# Altium project STM32_Esqumaticos.PrjPCB
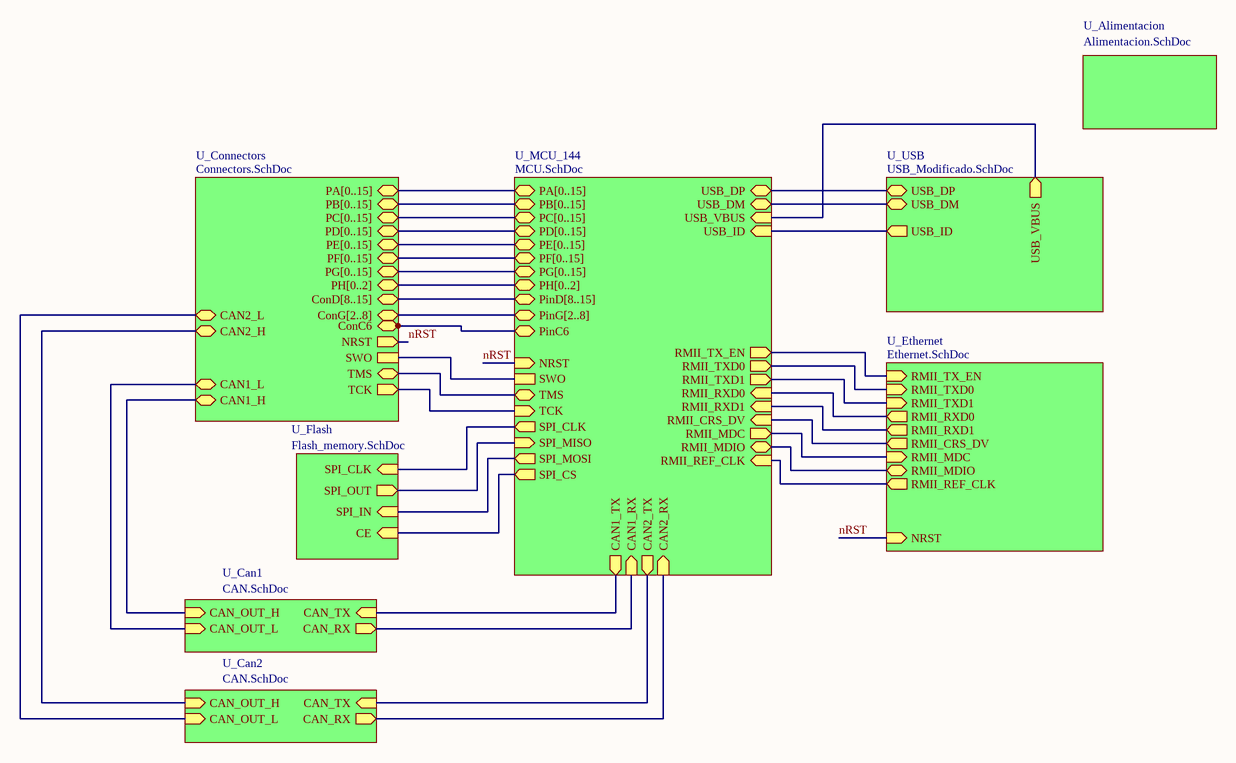
[diagram p0: STM32_TOP.SchDoc]
9 sheets, 175 parts. Net scope: hierarchical (ports join the sheet entries above them; power ports are global).
Board files: MB1137.PcbDoc, STM32_PCB.PcbDoc
Sheets:
  STM32_TOP.SchDoc
    U_MCU_144 = MCU.SchDoc
    U_Ethernet = Ethernet.SchDoc
    U_Connectors = Connectors.SchDoc
      U_ADC1 = ADC.SchDoc
      U_ADC2 = ADC.SchDoc
    U_USB = USB_Modificado.SchDoc
    U_Flash = Flash_memory.SchDoc
    U_Alimentacion = Alimentacion.SchDoc
    U_Can1 = CAN.SchDoc
    U_Can2 = CAN.SchDoc

## Sheet STM32_TOP.SchDoc
size A4

### Sub-sheets
U_Alimentacion = Alimentacion.SchDoc: no entries
U_Can1 = CAN.SchDoc: CAN_OUT_H (in), CAN_OUT_L (in), CAN_RX (out), CAN_TX (in)
U_Can2 = CAN.SchDoc: CAN_OUT_H (in), CAN_OUT_L (in), CAN_RX (out), CAN_TX (in)
U_Connectors = Connectors.SchDoc: PA[0..15] (bidir), PB[0..15] (bidir), PC[0..15] (bidir), PD[0..15] (bidir), PE[0..15] (bidir), PF[0..15] (bidir), PG[0..15] (bidir), PH[0..2] (bidir), CAN2_H (bidir), CAN2_L (bidir), CAN1_H (bidir), CAN1_L (bidir), ConD[8..15] (bidir), ConG[2..8] (bidir), TCK (out), TMS (bidir), SWO, NRST (out), ConC6 (bidir)
U_Ethernet = Ethernet.SchDoc: RMII_TXD0 (in), RMII_TX_EN (in), RMII_RXD0 (out), RMII_REF_CLK (out), RMII_CRS_DV (out), RMII_MDC (in), RMII_MDIO (bidir), NRST (in), RMII_TXD1 (in), RMII_RXD1 (out)
U_Flash = Flash_memory.SchDoc: SPI_CLK (in), SPI_OUT (out), SPI_IN (in), CE (in)
U_MCU_144 = MCU.SchDoc: PA[0..15] (bidir), PB[0..15] (bidir), PC[0..15] (bidir), PD[0..15] (bidir), PE[0..15] (bidir), PF[0..15] (bidir), PG[0..15] (bidir), PH[0..2] (bidir), USB_DM (bidir), USB_DP (bidir), USB_ID (in), USB_VBUS (in), RMII_TXD0 (out), RMII_TX_EN (out), RMII_RXD0 (in), RMII_REF_CLK (in), RMII_CRS_DV (in), RMII_MDC (out), RMII_MDIO (bidir), RMII_TXD1 (out), RMII_RXD1 (in), SPI_MISO (in), SPI_MOSI (out), SPI_CS (out), SPI_CLK (out), CAN1_TX (out), CAN1_RX (in), CAN2_TX (out), CAN2_RX (in), PinD[8..15] (bidir), PinG[2..8] (bidir), TCK (in), TMS (bidir), SWO, NRST (in), PinC6 (bidir)
U_USB = USB_Modificado.SchDoc: USB_DM (bidir), USB_DP (bidir), USB_ID (out), USB_VBUS (out)

### Nets
USB_PWR: sheet U_MCU_144/USB_VBUS, sheet U_USB/USB_VBUS
CAN_N: sheet U_Connectors/CAN2_L, sheet U_Can2/CAN_OUT_L
CAN_N: sheet U_Connectors/CAN1_L, sheet U_Can1/CAN_OUT_L  [a separate net that carries the same name]
CAN_P: sheet U_Connectors/CAN2_H, sheet U_Can2/CAN_OUT_H
CAN_P: sheet U_Connectors/CAN1_H, sheet U_Can1/CAN_OUT_H  [a separate net that carries the same name]
CE: sheet U_MCU_144/SPI_CS, sheet U_Flash/CE
ConC6: sheet U_MCU_144/PinC6, sheet U_Connectors/ConC6
DATA_N: sheet U_MCU_144/USB_DM, sheet U_USB/USB_DM
DATA_P: sheet U_MCU_144/USB_DP, sheet U_USB/USB_DP
nRST: sheet U_MCU_144/NRST, sheet U_Ethernet/NRST, sheet U_Connectors/NRST
PA1: sheet U_MCU_144/RMII_REF_CLK, sheet U_Ethernet/RMII_REF_CLK
PA2: sheet U_MCU_144/RMII_MDIO, sheet U_Ethernet/RMII_MDIO
PA7: sheet U_MCU_144/RMII_CRS_DV, sheet U_Ethernet/RMII_CRS_DV
PA10: sheet U_MCU_144/USB_ID, sheet U_USB/USB_ID
PA13: sheet U_MCU_144/TMS, sheet U_Connectors/TMS
PA14: sheet U_MCU_144/TCK, sheet U_Connectors/TCK
PB3: sheet U_MCU_144/SWO, sheet U_Connectors/SWO
PB5: sheet U_MCU_144/CAN2_RX, sheet U_Can2/CAN_RX
PB6: sheet U_MCU_144/CAN2_TX, sheet U_Can2/CAN_TX
PB13: sheet U_MCU_144/RMII_TXD1, sheet U_Ethernet/RMII_TXD1
PB14: sheet U_MCU_144/SPI_MISO, sheet U_Flash/SPI_OUT
PC1: sheet U_MCU_144/RMII_MDC, sheet U_Ethernet/RMII_MDC
PC4: sheet U_MCU_144/RMII_RXD0, sheet U_Ethernet/RMII_RXD0
PC5: sheet U_MCU_144/RMII_RXD1, sheet U_Ethernet/RMII_RXD1
PD0: sheet U_MCU_144/CAN1_RX, sheet U_Can1/CAN_RX
PD1: sheet U_MCU_144/CAN1_TX, sheet U_Can1/CAN_TX
PG11: sheet U_MCU_144/RMII_TX_EN, sheet U_Ethernet/RMII_TX_EN
PG13: sheet U_MCU_144/RMII_TXD0, sheet U_Ethernet/RMII_TXD0
SPI_CLK: sheet U_MCU_144/SPI_CLK, sheet U_Flash/SPI_CLK
SPI_IN: sheet U_MCU_144/SPI_MOSI, sheet U_Flash/SPI_IN

### Buses and harness runs
bus sheet U_Connectors/ConD[8..15] = sheet U_MCU_144/PinD[8..15]
bus sheet U_Connectors/ConG[2..8] = sheet U_MCU_144/PinG[2..8]
bus sheet U_Connectors/PA[0..15] = sheet U_MCU_144/PA[0..15]
bus sheet U_Connectors/PB[0..15] = sheet U_MCU_144/PB[0..15]
bus sheet U_Connectors/PC[0..15] = sheet U_MCU_144/PC[0..15]
bus sheet U_Connectors/PD[0..15] = sheet U_MCU_144/PD[0..15]
bus sheet U_Connectors/PE[0..15] = sheet U_MCU_144/PE[0..15]
bus sheet U_Connectors/PF[0..15] = sheet U_MCU_144/PF[0..15]
bus sheet U_Connectors/PG[0..15] = sheet U_MCU_144/PG[0..15]
bus sheet U_Connectors/PH[0..2] = sheet U_MCU_144/PH[0..2]

## Sheet MCU.SchDoc: MCU
size A3; DocumentNumber: MB1137; Revision: B-01; SheetNumber: 2; SheetTotal: 6; Project: NUCLEO-XXXXZX
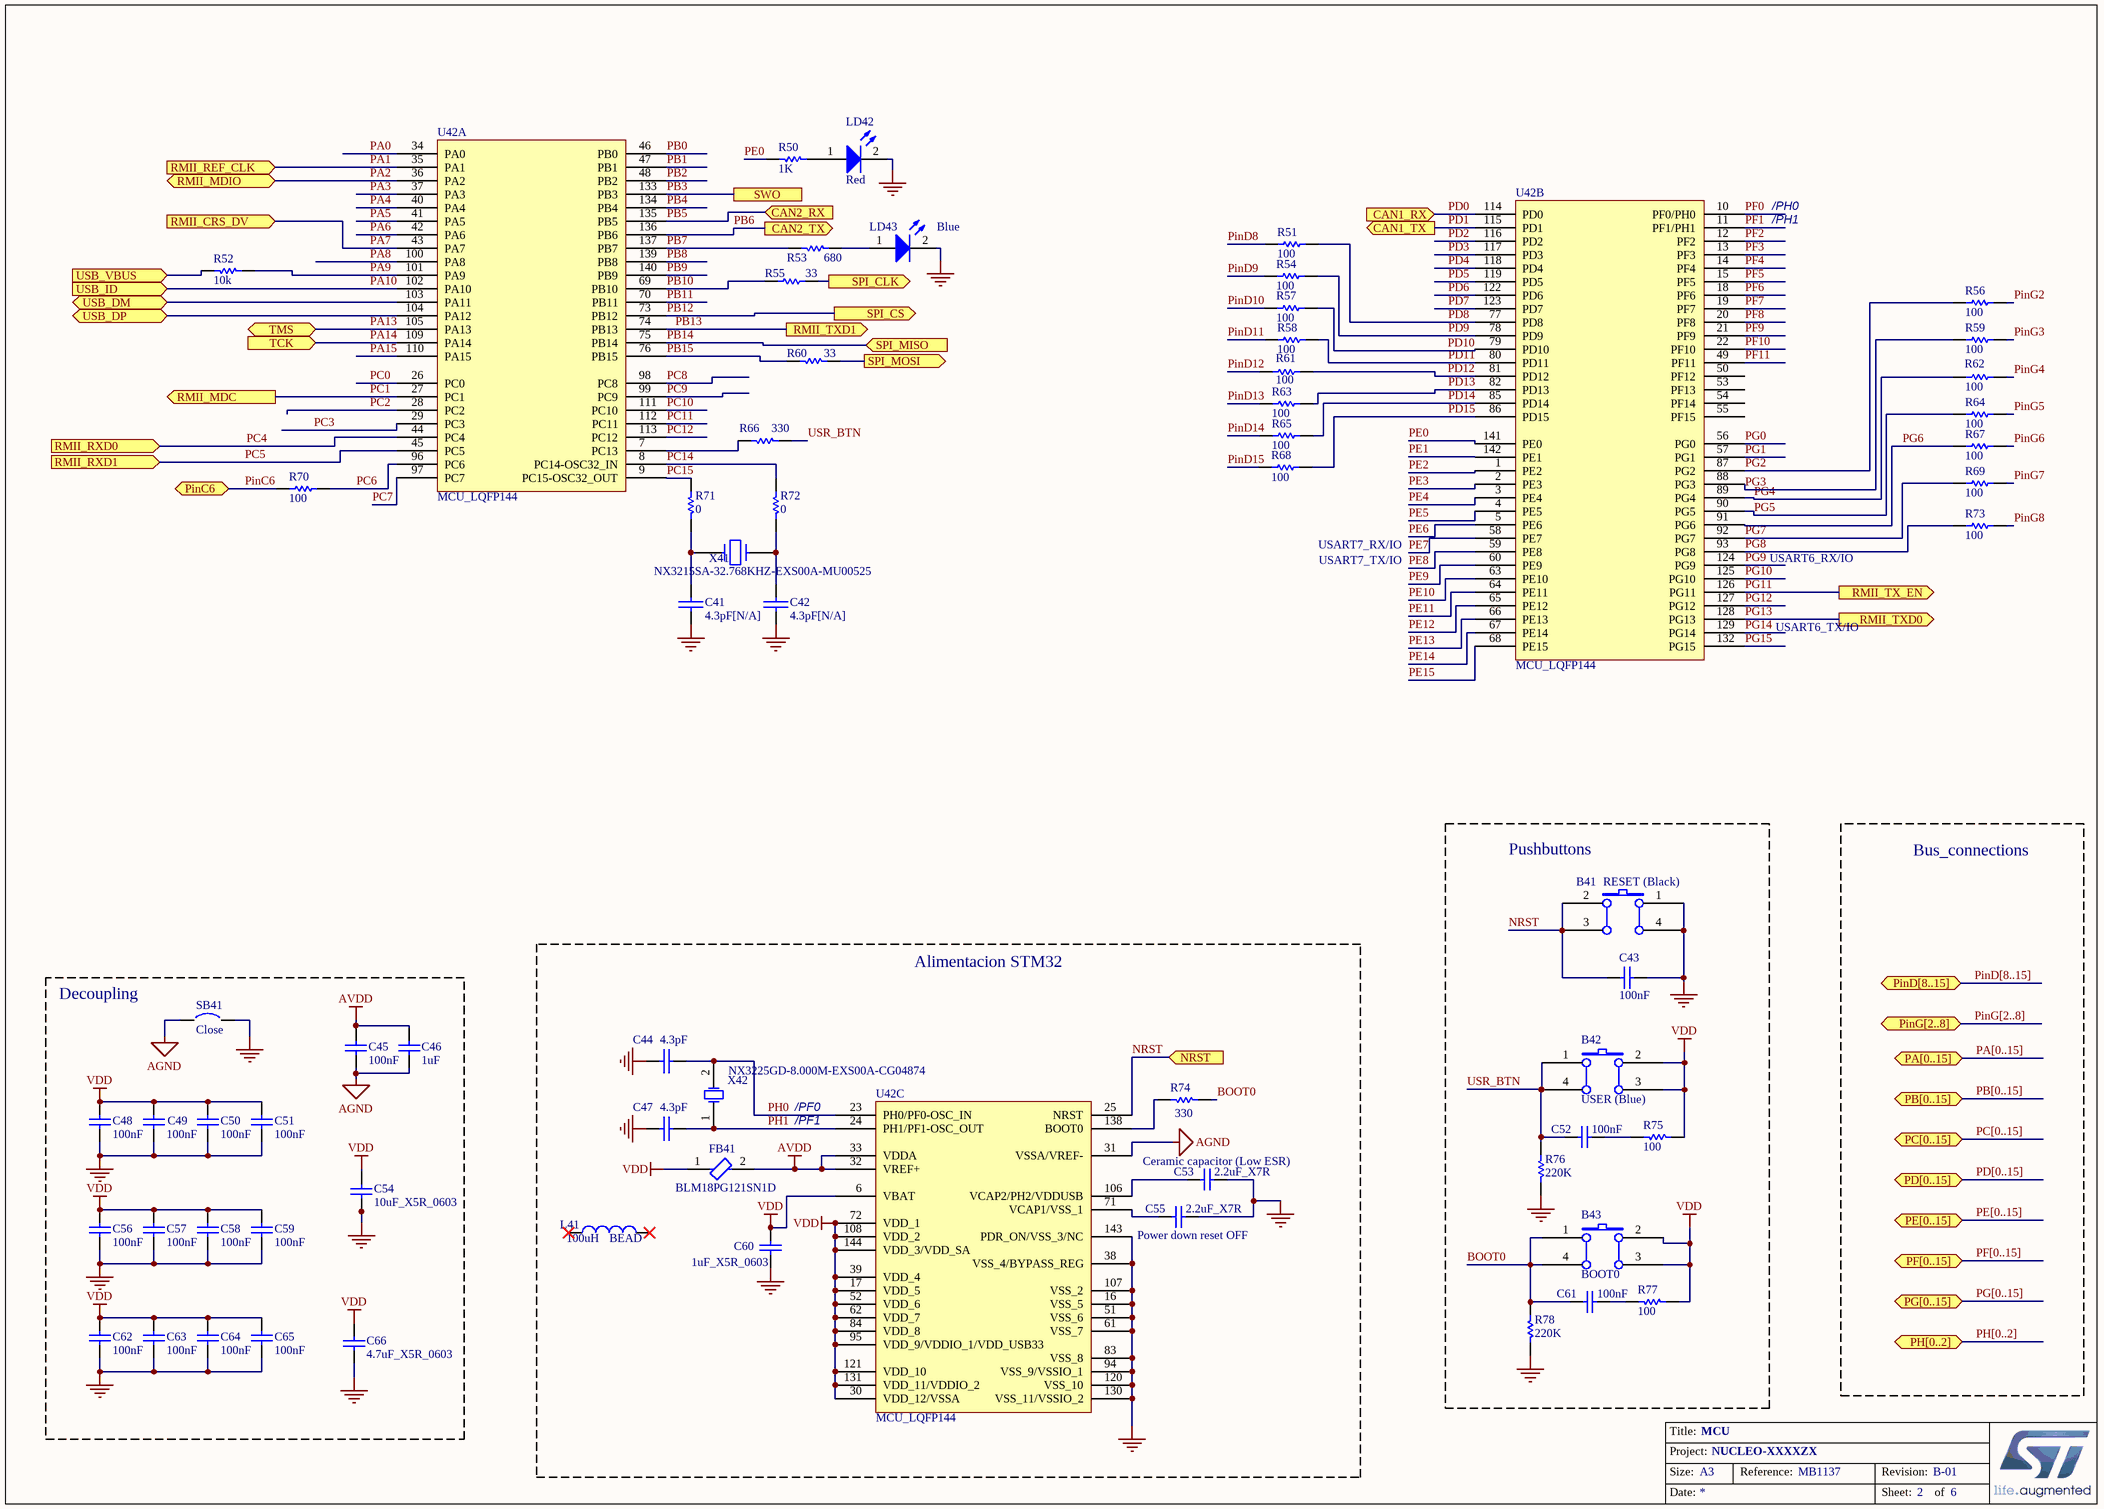
[diagram p1: MCU.SchDoc]

### Parts
B41  RESET (Black)  [PB-6X6mm-Black]
B42  USER (Blue)  [PB-6X6mm-Blue]
B43  BOOT0  [PB-6X6mm-Blue]
C41  4.3pF[N/A]  [0603C]
C42  4.3pF[N/A]  [0603C]
C43  100nF  [0603C]
C44  4.3pF  [0603C]
C45  100nF  [0603C]
C46  1uF  [0603C]
C47  4.3pF  [0603C]
C48  100nF  [0603C]
C49  100nF  [0603C]
C50  100nF  [0603C]
C51  100nF  [0603C]
C52  100nF  [0603C]
C53  2.2uF_X7R  [TAN-A]
C54  10uF_X5R_0603  [0603C]
C55  2.2uF_X7R  [TAN-A]
C56  100nF  [0603C]
C57  100nF  [0603C]
C58  100nF  [0603C]
C59  100nF  [0603C]
C60  1uF_X5R_0603  [0603C]
C61  100nF  [0603C]
C62  100nF  [0603C]
C63  100nF  [0603C]
C64  100nF  [0603C]
C65  100nF  [0603C]
C66  4.7uF_X5R_0603  [0603C]
FB41  BLM18PG121SN1D  [FP-BLM18-0_15-t0_8-IPC_A]
L41  BEAD  value 100uH  (graphical)
LD42  Red  [0603D-R]
LD43  Blue  [0603D-B]
R50  1K  [0603R]
R51  100  [0603R]
R52  10k  [0603R]
R53  680  [0603R]
R54  100  [0603R]
R55  33  [0603R]
R56  100  [0603R]
R57  100  [0603R]
R58  100  [0603R]
R59  100  [0603R]
R60  33  [0603R]
R61  100  [0603R]
R62  100  [0603R]
R63  100  [0603R]
R64  100  [0603R]
R65  100  [0603R]
R66  330  [0603R]
R67  100  [0603R]
R68  100  [0603R]
R69  100  [0603R]
R70  100  [0603R]
R71  0  [0603R]
R72  0  [0603R]
R73  100  [0603R]
R74  330  [0603R]
R75  100  [0603R]
R76  220K  [0603R]
R77  100  [0603R]
R78  220K  [0603R]
SB41  Close  [SB_0603]
U42  MCU_LQFP144  [LQFP144_0R5_SKT - sin_zocalo_UWU]  (parts A,B,C of 3)
X41  NX3215SA-32.768KHZ-EXS00A-MU00525  [XTAL_2SM_3R2X1R5]
X42  NX3225GD-8.000M-EXS00A-CG04874  [OSC_2SM_3R2x2R5]

### Blocks framed on the sheet
Pushbuttons: B41-B43 C43 C52 C61 R75-R78
Decoupling: C45 C46 C48-C51 C54 C56-C59 C62-C66 SB41
Alimentacion STM32: C44 C47 C53 C55 C60 FB41 L41 R74 U42 X42

### Ports
CAN1_RX (in), CAN1_TX (out), CAN2_RX (in), CAN2_TX (out), NRST (in), PA[0..15] (bidir), PB[0..15] (bidir), PC[0..15] (bidir), PD[0..15] (bidir), PE[0..15] (bidir), PF[0..15] (bidir), PG[0..15] (bidir), PH[0..2] (bidir), PinC6 (bidir), PinD[8..15] (bidir), PinG[2..8] (bidir), RMII_CRS_DV (in), RMII_MDC (out), RMII_MDIO (bidir), RMII_REF_CLK (in), RMII_RXD0 (in), RMII_RXD1 (in), RMII_TX_EN (out), RMII_TXD0 (out), RMII_TXD1 (out), SPI_CLK (out), SPI_CS (out), SPI_MISO (in), SPI_MOSI (out), SWO, TCK (in), TMS (bidir), USB_DM (bidir), USB_DP (bidir), USB_ID (in), USB_VBUS (in)

### Nets
AGND: C45.2 C46.2 SB41.1 U42.31(VSSA/VREF-)
AVDD: C45.1 C46.1 FB41.2 U42.32(VREF+) U42.33(VDDA)
GND: B41.1(A0) B41.4(A1) C41.2 C42.2 C43.1 C44.2 C47.2 C48.2 C49.2 C50.2 C51.2 C53.2 C54.2 C55.2 C56.2 C57.2 C58.2 C59.2 C60.2 C62.2 C63.2 C64.2 C65.2 C66.2 LD42.2(K) LD43.2(K) R76.2 R78.2 SB41.2 U42.16(VSS_5) U42.38(VSS_4/BYPASS_REG) U42.51(VSS_6) U42.61(VSS_7) U42.83(VSS_8) U42.94(VSS_9/VSSIO_1) U42.107(VSS_2) U42.120(VSS_10) U42.130(VSS_11/VSSIO_2) U42.143(PDR_ON/VSS_3/NC)
USB_PWR: R52.1 ; port USB_VBUS
VDD: B42.2(B0) B42.3(B1) B43.2(B0) B43.3(B1) C48.1 C49.1 C50.1 C51.1 C54.1 C56.1 C57.1 C58.1 C59.1 C60.1 C62.1 C63.1 C64.1 C65.1 C66.1 FB41.1 R75.1 R77.1 U42.6(VBAT) U42.17(VDD_5) U42.30(VDD_12/VSSA) U42.39(VDD_4) U42.52(VDD_6) U42.62(VDD_7) U42.72(VDD_1) U42.84(VDD_8) U42.95(VDD_9/VDDIO_1/VDD_USB33) U42.108(VDD_2) U42.121(VDD_10) U42.131(VDD_11/VDDIO_2) U42.144(VDD_3/VDD_SA)  [project net P3V3]
BOOT0: B43.1(A0) B43.4(A1) C61.2 R74.2 R78.1
DATA_N: U42.103(PA11) ; port USB_DM
DATA_P: U42.104(PA12) ; port USB_DP
nRST: B41.2(B0) B41.3(B1) C43.2 U42.25(NRST) ; port NRST
PA0: U42.34(PA0)
PA1: U42.35(PA1) ; port RMII_REF_CLK
PA2: U42.36(PA2) ; port RMII_MDIO
PA3: U42.37(PA3)
PA4: U42.40(PA4)
PA5: U42.41(PA5)
PA6: U42.42(PA6)
PA7: U42.43(PA7) ; port RMII_CRS_DV
PA8: U42.100(PA8)
PA9: R52.2 U42.101(PA9)
PA10: U42.102(PA10) ; port USB_ID
PA13: U42.105(PA13) ; port TMS
PA14: U42.109(PA14) ; port TCK
PA15: U42.110(PA15)
PB0: U42.46(PB0)
PB1: U42.47(PB1)
PB2: U42.48(PB2)
PB3: U42.133(PB3) ; port SWO
PB4: U42.134(PB4)
PB5: U42.135(PB5) ; port CAN2_RX
PB6: U42.136(PB6) ; port CAN2_TX
PB7: R53.1 U42.137(PB7)
PB8: U42.139(PB8)
PB9: U42.140(PB9)
PB10: R55.1 U42.69(PB10)
PB11: U42.70(PB11)
PB12: U42.73(PB12) ; port SPI_CS  [project net CE]
PB13: U42.74(PB13) ; port RMII_TXD1
PB14: U42.75(PB14) ; port SPI_MISO
PB15: R60.1 U42.76(PB15)
PC0: U42.26(PC0)
PC1: U42.27(PC1) ; port RMII_MDC
PC2: U42.28(PC2)
PC3: U42.29(PC3)
PC4: U42.44(PC4) ; port RMII_RXD0
PC5: U42.45(PC5) ; port RMII_RXD1
PC6: R70.2 U42.96(PC6)
PC7: U42.97(PC7)
PC8: U42.98(PC8)
PC9: U42.99(PC9)
PC10: U42.111(PC10)
PC11: U42.112(PC11)
PC12: U42.113(PC12)
PC14: R72.2 U42.8(PC14-OSC32_IN)
PC15: R71.2 U42.9(PC15-OSC32_OUT)
PD0: U42.114(PD0) ; port CAN1_RX
PD1: U42.115(PD1) ; port CAN1_TX
PD2: U42.116(PD2)
PD3: U42.117(PD3)
PD4: U42.118(PD4)
PD5: U42.119(PD5)
PD6: U42.122(PD6)
PD7: U42.123(PD7)
PD8: R51.1 U42.77(PD8)
PD9: R54.1 U42.78(PD9)
PD10: R57.1 U42.79(PD10)
PD11: R58.1 U42.80(PD11)
PD12: R61.1 U42.81(PD12)
PD13: R63.2 U42.82(PD13)
PD14: R65.1 U42.85(PD14)
PD15: R68.2 U42.86(PD15)
PE0: R50.2 U42.141(PE0)
PE1: U42.142(PE1)
PE2: U42.1(PE2)
PE3: U42.2(PE3)
PE4: U42.3(PE4)
PE5: U42.4(PE5)
PE6: U42.5(PE6)
PE7: U42.58(PE7)
PE8: U42.59(PE8)
PE9: U42.60(PE9)
PE10: U42.63(PE10)
PE11: U42.64(PE11)
PE12: U42.65(PE12)
PE13: U42.66(PE13)
PE14: U42.67(PE14)
PE15: U42.68(PE15)
PF0: U42.10(PF0/PH0)
PF1: U42.11(PF1/PH1)
PF2: U42.12(PF2)
PF3: U42.13(PF3)
PF4: U42.14(PF4)
PF5: U42.15(PF5)
PF6: U42.18(PF6)
PF7: U42.19(PF7)
PF8: U42.20(PF8)
PF9: U42.21(PF9)
PF10: U42.22(PF10)
PF11: U42.49(PF11)
PG0: U42.56(PG0)
PG1: U42.57(PG1)
PG2: R56.2 U42.87(PG2)
PG3: R59.2 U42.88(PG3)
PG4: R62.1 U42.89(PG4)
PG5: R64.1 U42.90(PG5)
PG6: R67.2 U42.91(PG6)
PG7: R69.2 U42.92(PG7)
PG8: R73.2 U42.93(PG8)
PG9: U42.124(PG9)
PG10: U42.125(PG10)
PG11: U42.126(PG11) ; port RMII_TX_EN
PG12: U42.127(PG12)
PG13: U42.128(PG13) ; port RMII_TXD0
PG14: U42.129(PG14)
PG15: U42.132(PG15)
PH0: C44.1 U42.23(PH0/PF0-OSC_IN) X42.2(OSC2)
PH1: C47.1 U42.24(PH1/PF1-OSC_OUT) X42.1(OSC1)
PinC6: R70.1 ; port PinC6  [project net ConC6]
PinD8: R51.2  [project net ConD8]
PinD9: R54.2  [project net ConD9]
PinD10: R57.2  [project net ConD10]
PinD11: R58.2  [project net ConD11]
PinD12: R61.2  [project net ConD12]
PinD13: R63.1  [project net ConD13]
PinD14: R65.2  [project net ConD14]
PinD15: R68.1  [project net ConD15]
PinG2: R56.1  [project net ConG2]
PinG3: R59.1  [project net ConG3]
PinG4: R62.2  [project net ConG4]
PinG5: R64.2  [project net ConG5]
PinG6: R67.1  [project net ConG6]
PinG7: R69.1  [project net ConG7]
PinG8: R73.1  [project net ConG8]
SPI_CLK: R55.2 ; port SPI_CLK
SPI_IN: R60.2 ; port SPI_MOSI
USR_BTN: B42.1(A0) B42.4(A1) C52.2 R66.1 R76.1
NetC41_1: C41.1 R71.1 X41.1
NetC42_1: C42.1 R72.1 X41.2
NetC52_1: C52.1 R75.2
NetC53_1: C53.1 U42.106(VCAP2/PH2/VDDUSB)
NetC55_1: C55.1 U42.71(VCAP1/VSS_1)
NetC61_1: C61.1 R77.2
NetLD42_1: LD42.1(A) R50.1
NetLD43_1: LD43.1(A) R53.2
NetR66_2: R66.2 U42.7(PC13)
NetR74_1: R74.1 U42.138(BOOT0)

Not connected (* = marked no-connect by the designer): L41 1* 2*; U42 50(PF12) 53(PF13) 54(PF14) 55(PF15)

### Buses and harness runs
bus PA[0..15] = port PA[0..15]
bus PB[0..15] = port PB[0..15]
bus PC[0..15] = port PC[0..15]
bus PD[0..15] = port PD[0..15]
bus PE[0..15] = port PE[0..15]
bus PF[0..15] = port PF[0..15]
bus PG[0..15] = port PG[0..15]
bus PH[0..2] = port PH[0..2]
bus PinD[8..15] = port PinD[8..15]
bus PinG[2..8] = port PinG[2..8]

### Notes on the sheet
- /PH0
- /PH1
- USART7_TX/IO
- USART7_RX/IO
- USART6_RX/IO
- USART6_TX/IO
- Bus_connections
- /PF0
- /PF1
- (near C53) Ceramic capacitor (Low ESR)
- (near C55) Power down reset OFF
- Title:
- Project:
- Size:
- Date:
- A3
- Reference:
- Sheet:
- Revision:
- of

### Library data of the parts
B41-B43 = SW PUSHBUTTON: SE PUSHBUTTON
C41 C42 C44 C47 = CAP: Capacitor
C43 C52 C61 = CAP: Capacitor; Value: 100pF; Published: 8-Jun-2000; Revision: July-2002: Re-released for DXP Platform.; Publisher: Altium Limited
C45 C46 C48-C51 C56-C59 C62-C65 = Cap: Capacitor; Value: 10nF; Published: 8-Jun-2000; Revision: July-2002: Re-released for DXP Platform.; Publisher: Altium Limited
C53 C55 = Cap_2.2uF_X7R_10%_0805: Capacitor,2.2uF,16V, X7R,10%,0805,YAGEO; Manuf_Part_1: CC0805KKX7R7BB225; Revision: July-2002: Re-released for DXP Platform.; Value: 2.2uF; Order: CC0805KKX7R7BB225; Manuf_1: YAGEO
C54 C66 = CAP SMD 0603  X5R 1µF 25V 10%: 0603  X5R 4.7uF; Value: 1µF; Rated voltage: 25V; Tolerance: 10%; Manufacturer: *; Manufacturer P/N: *; Order code Farnell: 1288202RL; Power: *; Technology: X5R; Temperature  Factor: *; Temperature Max: +125°C; Temperature Min: -55°C; STS Code: *
C60 = CAP SMD 0603  X5R 1µF 25V 10%: 0603  X5R 1µF; Rated voltage: 25V; Tolerance: 10%; Manufacturer: *; Manufacturer P/N: *; Order code Farnell: 1288202RL; Value: 1µF; Power: *; Technology: X5R; Temperature  Factor: *; Temperature Max: +125°C; Temperature Min: -55°C; STS Code: *
FB41 = CMP-0686-00557-7: Chip Ferrite Bead, 0603, 120Ω @ 100MHz, 0.05Ω, 25%, 2A; Impedance: 120R; Number of Circuits: 1; Shielding: Unshielded; Material: Steel; DC Resistance (DCR): 50mR; Case Code (Imperial): 0603; RoHS Compliant: Yes; Number of Pins: 2; Min Operating Temperature: -55°C; Case Code (Metric): 1608; Frequency: 100MHz; Length: 1.6mm; Test Frequency: 100MHz; Max Operating Temperature: 125°C; Packaging: Tape and Reel; Max Current Rating: 2A; Termination: SMD/SMT; Lead Free: Lead Free; Max DC Current: 2A; Case/Package: 0603; Height: 0.8mm; Current Rating: 2A; Radiation Hardening: No; Core Material: Ferrite; DC Current: 2A; REACH SVHC: No SVHC; Package Quantity: 1; Depth: 0.8mm; Number of Lines: 1; Tolerance: 25%; Width: 0.8mm
L41 = Inductor: Published: 8-Jun-2000; Revision: July-2002: Re-released for DXP Platform.; Publisher: Altium Limited
LD42 LD43 = LED2: Typical RED, GREEN, YELLOW, AMBER GaAs LED; Published: 8-Jun-2000; Revision: July-2002: Re-released for DXP Platform.; Publisher: Altium Limited
R50 = Res1: Resistor; Published: 8-Jun-2000; Revision: July-2002: Re-released for DXP Platform.; Publisher: Altium Limited; Value: 1K
R51 R54 R56-R59 R61-R65 R67-R70 R73 = Resistor_ST: Resistor 0402 / 0603 / 0805; Value: 10K
R52 R53 R60 R66 R71 R72 R74 R75 R77 = Res1: Resistor; Value: 1K; Published: 8-Jun-2000; Revision: July-2002: Re-released for DXP Platform.; Publisher: Altium Limited
R55 = Res1: Resistor; Ordered by: Subcon; Value: 33; Published: 8-Jun-2000; Revision: July-2002: Re-released for DXP Platform.; Publisher: Altium Limited
R76 R78 = res1: Resistor; Value: 1K; Published: 8-Jun-2000; Revision: July-2002: Re-released for DXP Platform.; Publisher: Altium Limited
SB41 = Circuit Breaker: Published: 24-Mar-1999; Revision: July-2002: Re-released for DXP Platform.; Publisher: Altium Limited
X41 = CRYSTAL_32K: Crystal
X42 = XTAL: Crystal Oscillator; Published: 8-Jun-2000; LatestRevisionDate: 17-Jul-2002; LatestRevisionNote: Re-released for DXP Platform.; PackageReference: R38; Publisher: Altium Limited

## Sheet Ethernet.SchDoc: Ethernet PHY with RJ45 connector
size A4; Author: A.B; CompanyName: STMicroelectronics; Address1: 12, Rue Jules HOROWITZ; Address2: 38019 Grenoble; Address3: FRANCE; DocumentNumber: MB1137; Revision: B-01; SheetNumber: 5; SheetTotal: 6; Project: NUCLEO-XXXXZX
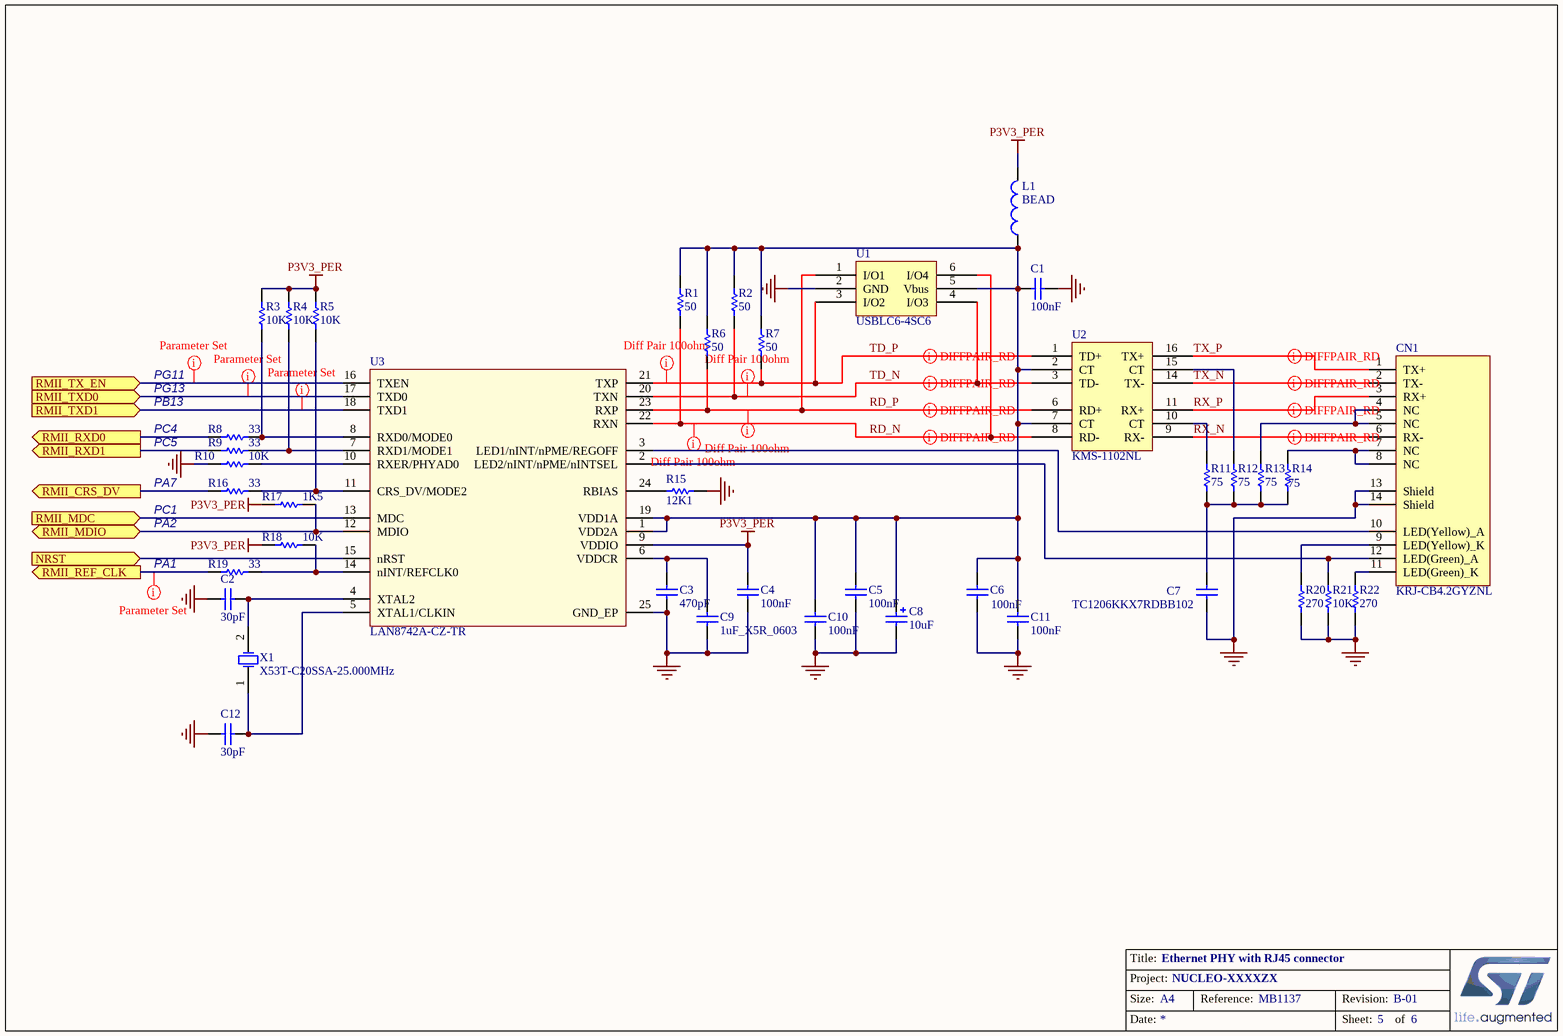
[diagram p2: Ethernet.SchDoc]

### Parts
C1  100nF  [0603C]
C2  30pF  [0603C]
C3  470pF  [0603C]
C4  100nF  [0603C]
C5  100nF  [0603C]
C6  100nF  [0603C]
C7  TC1206KKX7RDBB102  [1206C]
C8  10uF  [TAN-A]
C9  1uF_X5R_0603  [0603C]
C10  100nF  [0603C]
C11  100nF  [0603C]
C12  30pF  [0603C]
CN1  KRJ-CB4.2GYZNL  [RJ45_KRJ-CB4.2GYZNL]
L1  BEAD  [0603L]
R1  50  [0603R]
R2  50  [0603R]
R3  10K  [0603R]
R4  10K  [0603R]
R5  10K  [0603R]
R6  50  [0603R]
R7  50  [0603R]
R8  33  [0603R]
R9  33  [0603R]
R10  10K  [0603R]
R11  75  [0603R]
R12  75  [0603R]
R13  75  [0603R]
R14  75  [0603R]
R15  12K1  [0603R]
R16  33  [0603R]
R17  1K5  [0603R]
R18  10K  [0603R]
R19  33  [0603R]
R20  270  [0603R]
R21  10K  [0603R]
R22  270  [0603R]
U1  USBLC6-4SC6  [SOT23-6L]
U2  KMS-1102NL  [Transformer]
U3  LAN8742A-CZ-TR  [QFN24_0R5_4X4]
X1  X53T-C20SSA-25.000MHz  [XTAL_2SM_5R0X3R2]

### Ports
NRST (in), RMII_CRS_DV (out), RMII_MDC (in), RMII_MDIO (bidir), RMII_REF_CLK (out), RMII_RXD0 (out), RMII_RXD1 (out), RMII_TX_EN (in), RMII_TXD0 (in), RMII_TXD1 (in)

### Nets
GND: C1.1 C2.2 C3.1 C4.1 C5.1 C6.1 C7.1 C8.2 C9.2 C10.1 C11.1 C12.2 CN1.13(Shield) CN1.14(Shield) R10.2 R15.2 R20.2 R21.2 R22.2 U1.2(GND) U3.25(GND_EP)
P3V3_PER: C4.2 L1.2 R3.1 R4.1 R5.1 R17.2 R18.1 U3.9(VDDIO)  [project net P3V3]
nRST: U3.15(nRST) ; port NRST
PA1: R19.2 ; port RMII_REF_CLK
PA2: R17.1 U3.12(MDIO) ; port RMII_MDIO
PA7: R16.2 ; port RMII_CRS_DV
PB13: U3.18(TXD1) ; port RMII_TXD1
PC1: U3.13(MDC) ; port RMII_MDC
PC4: R8.2 ; port RMII_RXD0
PC5: R9.2 ; port RMII_RXD1
PG11: U3.16(TXEN) ; port RMII_TX_EN
PG13: U3.17(TXD0) ; port RMII_TXD0
RD_N: R1.1 U1.6(I/O4) U2.8(RD-) U3.22(RXN)
RD_P: R6.1 U1.1(I/O1) U2.6(RD+) U3.23(RXP)
RX_N: CN1.6(RX-) U2.9(RX-)
RX_P: CN1.3(RX+) U2.11(RX+)
TD_N: R2.1 U1.4(I/O3) U2.3(TD-) U3.20(TXN)
TD_P: R7.1 U1.3(I/O2) U2.1(TD+) U3.21(TXP)
TX_N: CN1.2(TX-) U2.14(TX-)
TX_P: CN1.1(TX+) U2.16(TX+)
NetC1_2: C1.2 C5.2 C6.2 C8.1 C10.2 C11.2 L1.1 R1.2 R2.2 R6.2 R7.2 U1.5(Vbus) U2.2(CT) U2.7(CT) U3.1(VDD2A) U3.19(VDD1A)
NetC2_1: C2.1 U3.4(XTAL2) X1.2(OSC2)
NetC3_2: C3.2 C9.1 U3.6(VDDCR)
NetC7_2: C7.2 R11.1 R12.1 R13.1 R14.1
NetC12_1: C12.1 U3.5(XTAL1/CLKIN) X1.1(OSC1)
NetCN1_4: CN1.4(NC) CN1.5(NC) R13.2
NetCN1_7: CN1.7(NC) CN1.8(NC) R14.2
NetCN1_9: CN1.9(LED(Yellow)_K) R20.1
NetCN1_10: CN1.10(LED(Yellow)_A) U3.3(LED1/nINT/nPME/REGOFF)
NetCN1_11: CN1.11(LED(Green)_K) R22.1
NetCN1_12: CN1.12(LED(Green)_A) R21.1 U3.2(LED2/nINT/nPME/nINTSEL)
NetR3_2: R3.2 R8.1 U3.8(RXD0/MODE0)
NetR4_2: R4.2 R9.1 U3.7(RXD1/MODE1)
NetR5_2: R5.2 R16.1 U3.11(CRS_DV/MODE2)
NetR10_1: R10.1 U3.10(RXER/PHYAD0)
NetR11_2: R11.2 U2.10(CT)
NetR12_2: R12.2 U2.15(CT)
NetR15_1: R15.1 U3.24(RBIAS)
NetR18_2: R18.2 R19.1 U3.14(nINT/REFCLK0)

### Layout directives
differential pair: RD_N, RD_P, RX_N, RX_P, TD_N, TD_P, TX_N, TX_P
mark named Diff Pair 100ohm: RD_N, RD_P, TD_N, TD_P
rule Matched Net Lengths [Tolerance = 2mm]: PA1, PB13, PG11, PG13

### Notes on the sheet
- PG11
- PG13
- PB13
- PC4
- PC5
- PA7
- PC1
- PA2
- PA1
- Title:
- Project:
- Size:
- Date:
- A4
- Reference:
- Sheet:
- Revision:
- of

### Library data of the parts
C1 C4-C6 C10 C11 = Capacitor_ST: Capacitor 0402 / 0603 / 0805; Revision: July-2002: Re-released for DXP Platform.; Value: 100nF
C2 C3 C12 = Capacitor_ST: Capacitor 0402 / 0603 / 0805; Value: 100nF; Revision: July-2002: Re-released for DXP Platform.
C7 = Capacitor_ST: Capacitor 0402 / 0603 / 0805/ 1206; Value: 100nF; Revision: July-2002: Re-released for DXP Platform.
C8 = Cap_10uF_POL_10%_TANA: Polarized Capacitor,10uF,10V,10%,typeA,VISHAY; Manuf_Part_1: 293D106X9010A2TE3; Revision: July-2002: Re-released for DXP Platform.; Value: 10uF; Manuf_1: VISHAY; Order: *; ECCN_US/EU: n/a
C9 = CAP SMD 0603  X5R 1µF 25V 10%: as C60 on sheet MCU; Manufacturer: *; Manufacturer P/N: *; Order code Farnell: 1288202RL; Value: 1µF; Power: *; Technology: X5R; Temperature  Factor: *; Temperature Max: +125°C; Temperature Min: -55°C; STS Code: *
CN1 = KRJ-CB4.2GYZNL: 100 Base-TX (Fast Ethernet) SMD RJ45 single port (1x1) with LEDS Integrated Magnetics Connector; Manuf_1: HanRun; Manuf_Part_1: HR961160C; Manuf_2: Pulse Electronics Corporation; Manuf_Part_2: J3011G21DNLT; Manuf_3: K.O.D International Holding; Manuf_Part_3: RMT-119A-12F6-GY-04; Distrib: Sub Co; Order: *
L1 = Inductor: Value: 100uH; Published: 8-Jun-2000; Revision: July-2002: Re-released for DXP Platform.; Publisher: Altium Limited
R1 R2 R6 R7 = Res_50_1%_0603: Resistor,50,0603,1%,YAGEO; Manuf_Part_1: RC0402FR-0750RL; Value: 50; Manuf_1: YAGEO; Order: *; ECCN_US/EU: n/a; Distrib: FARNELL
R3-R5 R10 R18 R21 = Resistor_ST: Resistor 0402 / 0603 / 0805; Value: 10K
R8 R9 R16 R19 = Res_33_1%_0402: Resistor,33,0402,1%,YAGEO; Manuf_Part_1: RC0402FR-0733RL; Value: 33; Manuf_1: YAGEO; Order: *; ECCN_US/EU: n/a; Distrib: FARNELL
R11-R14 = Res_75_1%_0603: Resistor,75,0603,1%,YAGEO; Manuf_Part_1: RC0402FR-0750RL; Value: 50; Manuf_1: YAGEO; Order: *; ECCN_US/EU: n/a; Distrib: FARNELL
R15 = Res_12K1_1%_0603: Resistor,12K1,0603,1%,VISHAY; Manuf_Part_1: MCT 0603-50 1% P5 12K1; Order: 2325243; Value: 12K1; ECCN_US/EU: n/a; Manuf_1: VISHAY; Distrib: FARNELL
R17 = Res_1K5_1%_0402: Resistor,1K5,0402,1%,YAGEO; Manuf_Part_1: RC0402FR-071K5L; Value: 1K5; Manuf_1: YAGEO; Order: RC0402FR-071K5L; ECCN_US/EU: n/a; Distrib: FARNELL
R20 R22 = Resistor_ST: Resistor 0402 / 0603 / 0805; Value: 10K
U3 = LAN8742A-CZ-TR: LAN8742A-CZ-TR - Small Footprint RMII 10/100 Ethernet, Transceiver with HP Auto-MDIX and flexPWR Technology SQFN-24; Manuf_1: MICROCHIP; Order: LAN8742A-CZ-TR; Manuf_Part_1: LAN8742A-CZ-TR; Distrib: MICROCHIP
X1 = XTAL_5032: Crystal Oscillator; Published: 8-Jun-2000; LatestRevisionDate: 17-Jul-2002; LatestRevisionNote: Re-released for DXP Platform.; PackageReference: R38; Publisher: Altium Limited

## Sheet Connectors.SchDoc: Extension connectors
size A3; DocumentNumber: MB1137; Revision: B-01; SheetNumber: 6; SheetTotal: 6; Project: NUCLEO-XXXXZX
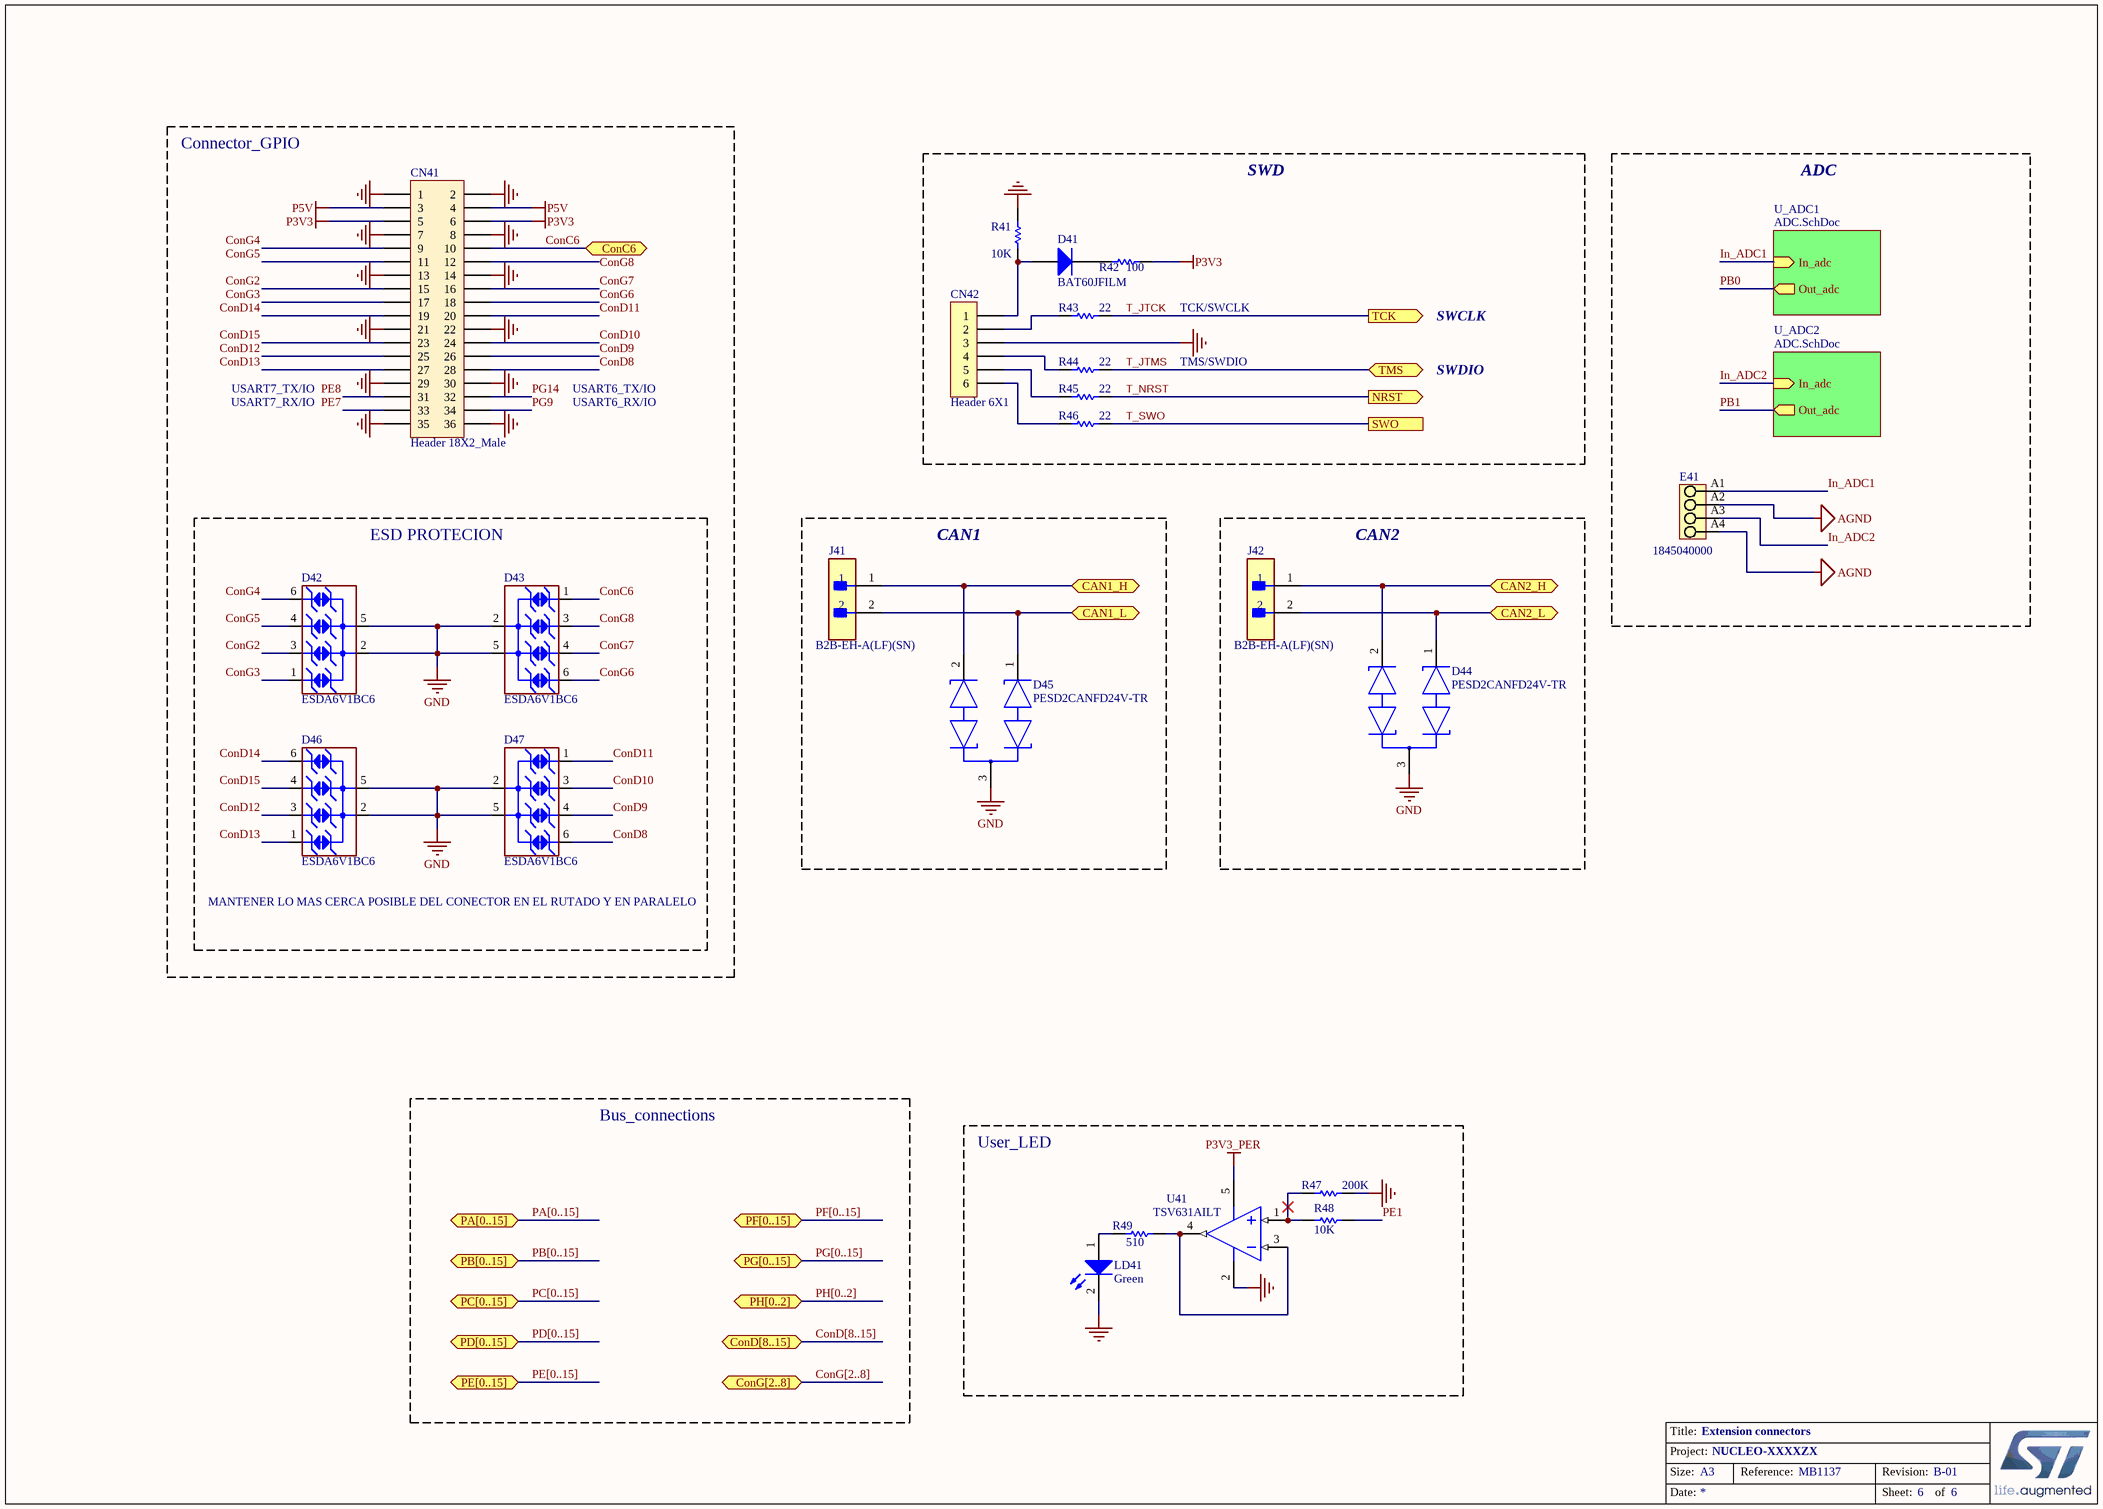
[diagram p3: Connectors.SchDoc]

### Parts
CN41  Header 18X2_Male  [HDR_2x18_2R54_V_M]
CN42  Header 6X1  [HDR_1x6_2R54_V_M]
D41  BAT60JFILM  [SOD-323]
D42  ESDA6V1BC6  [SOT23-6L]
D43  ESDA6V1BC6  [SOT23-6L]
D44  PESD2CANFD24V-TR  [FP-SOT23-IPC_A]
D45  PESD2CANFD24V-TR  [FP-SOT23-IPC_A]
D46  ESDA6V1BC6  [SOT23-6L]
D47  ESDA6V1BC6  [SOT23-6L]
E41  1845040000  [LM_3_5_90_04]
J41  B2B-EH-A(LF)(SN)  [FP-B2B-EH-A_LF_SN-MFG]
J42  B2B-EH-A(LF)(SN)  [FP-B2B-EH-A_LF_SN-MFG]
LD41  Green  [0603D-G]
R41  10K  [0603R]
R42  100  [0603R]
R43  22  [0603R]
R44  22  [0603R]
R45  22  [0603R]
R46  22  [0603R]
R47  200K  [0603R]
R48  10K  [0603R]
R49  510  [0603R]
U41  TSV631AILT  [SOT-23-5L]

### Blocks framed on the sheet
Connector_GPIO: CN41
SWD: CN42 D41 R41-R46
ADC: E41
ESD PROTECION: D42 D43 D46 D47
CAN1: D45 J41
CAN2: D44 J42
User_LED: LD41 R47-R49 U41

### Sub-sheets
U_ADC1 = ADC.SchDoc: In_adc (in), Out_adc (out)
U_ADC2 = ADC.SchDoc: In_adc (in), Out_adc (out)

### Ports
CAN1_H (bidir), CAN1_L (bidir), CAN2_H (bidir), CAN2_L (bidir), ConC6 (bidir), ConD[8..15] (bidir), ConG[2..8] (bidir), NRST (out), PA[0..15] (bidir), PB[0..15] (bidir), PC[0..15] (bidir), PD[0..15] (bidir), PE[0..15] (bidir), PF[0..15] (bidir), PG[0..15] (bidir), PH[0..2] (bidir), SWO, TCK (out), TMS (bidir)

### Nets
AGND: E41.A2 E41.A4
GND: CN41.1 CN41.2 CN41.7 CN41.8 CN41.13 CN41.14 CN41.21 CN41.22 CN41.29 CN41.30 CN41.35 CN41.36 CN42.3 D42.2(IO2) D42.5(IO4) D43.2(IO2) D43.5(IO4) D44.3(CC) D45.3(CC) D46.2(IO2) D46.5(IO4) D47.2(IO2) D47.5(IO4) LD41.2(K) R41.2 R47.2 U41.2(VDD)
P3V3: CN41.5 CN41.6 R42.2 U41.5(VCC)  [also labelled P3V3_PER]
P5V: CN41.3 CN41.4  [project net USB_PWR]
CAN_N: D44.1(K1) J42.2 ; port CAN2_L
CAN_N: D45.1(K1) J41.2 ; port CAN1_L  [a separate net that carries the same name]
CAN_P: D44.2(K2) J42.1 ; port CAN2_H
CAN_P: D45.2(K2) J41.1 ; port CAN1_H  [a separate net that carries the same name]
ConC6: CN41.10 D43.1(IO1) ; port ConC6
ConD8: CN41.28 D47.6(NC)
ConD9: CN41.26 D47.4(IO3)
ConD10: CN41.24 D47.3(GND)
ConD11: CN41.20 D47.1(IO1)
ConD12: CN41.25 D46.3(GND)
ConD13: CN41.27 D46.1(IO1)
ConD14: CN41.19 D46.6(NC)
ConD15: CN41.23 D46.4(IO3)
ConG2: CN41.15 D42.3(GND)
ConG3: CN41.17 D42.1(IO1)
ConG4: CN41.9 D42.6(NC)
ConG5: CN41.11 D42.4(IO3)
ConG6: CN41.18 D43.6(NC)
ConG7: CN41.16 D43.4(IO3)
ConG8: CN41.12 D43.3(GND)
In_ADC1: E41.A1 ; sheet U_ADC1/In_adc
In_ADC2: E41.A3 ; sheet U_ADC2/In_adc
PE1: R48.2
PE7: CN41.33
PE8: CN41.31
PG9: CN41.34
PG14: CN41.32
T_JTCK: R43.2 ; port TCK  [project net PA14]
T_JTMS: R44.2 ; port TMS  [project net PA13]
T_NRST: R45.2 ; port NRST  [project net nRST]
T_SWO: R46.2 ; port SWO  [project net PB3]
NetCN42_1: CN42.1 D41.1(A) R41.1
NetCN42_2: CN42.2 R43.1
NetCN42_4: CN42.4 R44.1
NetCN42_5: CN42.5 R45.1
NetCN42_6: CN42.6 R46.1
NetD41_2: D41.2(K) R42.1
NetLD41_1: LD41.1(A) R49.2
NetR47_1: R47.1 R48.1 U41.1(IN+)
NetR49_1: R49.1 U41.3(IN-) U41.4(OUT)

### Buses and harness runs
bus ConD[8..15] = port ConD[8..15]
bus ConG[2..8] = port ConG[2..8]
bus PA[0..15] = port PA[0..15]
bus PB[0..15] = port PB[0..15]
bus PC[0..15] = port PC[0..15]
bus PD[0..15] = port PD[0..15]
bus PE[0..15] = port PE[0..15]
bus PF[0..15] = port PF[0..15]
bus PG[0..15] = port PG[0..15]
bus PH[0..2] = port PH[0..2]

### Notes on the sheet
- TCK/SWCLK
- SWCLK
- TMS/SWDIO
- SWDIO
- USART7_TX/IO
- USART7_RX/IO
- USART6_TX/IO
- USART6_RX/IO
- MANTENER LO MAS CERCA POSIBLE DEL CONECTOR EN EL RUTADO Y EN PARALELO
- Bus_connections
- Title:
- Project:
- Size:
- Date:
- A3
- Reference:
- Sheet:
- Revision:
- of

### Library data of the parts
CN41 = Header 18X2_Male: Header, 18-Pin, Dual row,male; Publisher: Altium Limited
CN42 = Header 6X1: Header, 6-Pin, Single row; LatestRevisionDate: 17-Jul-2002; LatestRevisionNote: Re-released for DXP Platform.; Publisher: Altium Limited
D41 = BAT60JFILM: Manuf_1: STM; Provided: ST; ECCN_US/EU: EAR99/NEC; Revision: July-2002: Re-released for DXP Platform.; Order: BAT60JFILM; Manuf_Part_1: BAT60JFILM; Distrib: ST
D42 D43 D46 D47 = ESDA6V1BC6: 4-line ESD protection; Manuf_1: STM; Manuf_Part_1: ESDA5V3L; Ref St: 9179034; Provided: ST; ECCN_US/EU: EAR99/NEC; Distrib: ST; Order: ESDA5V3L; Ordered by: STM
D44 D45 = CMP-14436-000014-1: TVS DIODE 24VWM 42VC TO236AB
E41 = CMP-1559-01732-1: OMNIMATE Signal - series LM; Manufacturer: Weidmueller; Rated_voltage_use_group_B_UL_1059: 300 V; Short_text_for_material: LM 3.50/04/90 3.2SN OR BX; Wire_cross_section_AWG_min_UL_1059: AWG 28; Pitch_mm: 3,5 mm; Solder_pin_length_mm: 3,2 mm; Contact_material: Cu-Leg; Rated_current_min_no_of_poles_TU_20_deg_C: 19 A; Rated_current_use_group_B_UL_1059: 10 A; Side_termination_characteristic: closed side; Contact_surface: tinned; UL_94_flammability_rating: V-2; Pitch_inch: 0,138 inch; Insulating_material: PA; Solid_max_H05_07_V_U: 1,5 mm²; Rated_voltage_for_surge_voltage_class_pollution_degree_II_2: 320 V; Wire_cross_section_AWG_max_UL_1059: AWG 14; Mounting_onto_the_PCB: Solder connection; Solid_min_H05_07_V_U: 0,5 mm²; No_of_poles: 4; ComponentLink2Description: URL Link1; ComponentLink2URL: http://catalog.weidmueller.com/catalog/Start.do?localeId=en&ObjectID=1845040000; Qty: 100 PCS; Packaging: Box; Revision: V1; PartNumber: 1845040000; ComponentLink1Description: Manufacturer URL; ComponentLink1URL: http://www.weidmueller.com/; PackageReference: LM_3_5_90_04; Colour: Orange
J41 J42 = CMP-17439-000026-1: CONN HEADER VERT 2POS 2.5MM; Number of Contacts: 2; Current Rating: 3A; Connector Type: Plug; Contact Resistance: 20mR; Gender: Male; Voltage Rating: 250V; Fastening Type: Detent; Depth: 3.8mm; Max Operating Temperature: 85°C; Orientation: Straight; Series: EH; Contact Plating: Tin; Min Operating Temperature: -25°C; Contact Type: Male Pin; Housing Color: White; Termination: Press-Fit; Housing Material: Nylon; Pitch: 2.5mm; Number of Positions: 2; Max Current Rating: 3A; Packaging: Bulk; Lead Free: Lead Free; Number of Rows: 1; Length: 7.5mm; Contact Mating Length: 0.13inch; Color: Natural; Max Voltage Rating (AC): 250V; Contact Material: Copper Alloy; Mount: Through Hole
LD41 = LED2: as LD42 on sheet MCU; Published: 8-Jun-2000; Revision: July-2002: Re-released for DXP Platform.; Publisher: Altium Limited
R41 = Resistor_ST: Resistor 0402 / 0603 / 0805; Value: 10K
R42-R46 = Resistor_ST: Resistor 0402 / 0603 / 0805; Value: 10K
R47 R48 = res1: Resistor; Value: 1K; Published: 8-Jun-2000; Revision: July-2002: Re-released for DXP Platform.; Publisher: Altium Limited
R49 = Res1: Resistor; Value: 1K; Published: 8-Jun-2000; Revision: July-2002: Re-released for DXP Platform.; Publisher: Altium Limited

## Sheet ADC.SchDoc
size A4
Used 2 times, as channels U_Connectors/U_ADC1, U_Connectors/U_ADC2. Parts and nets are listed once, with the designators drawn on the sheet.
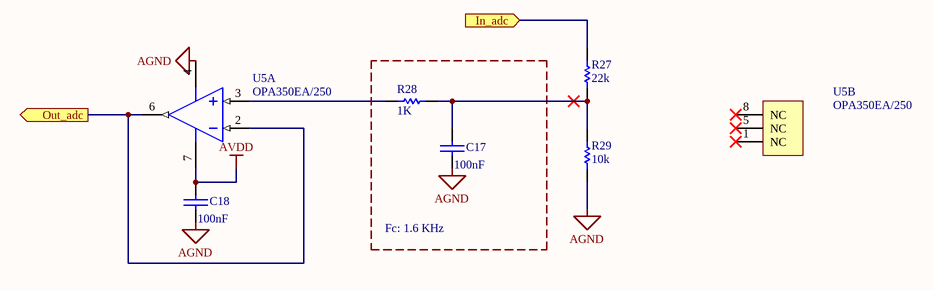
[diagram p4: ADC.SchDoc]

### Parts
C17  100nF  [0603C]
C18  100nF  [0603C]
R27  22k  [0603R]
R28  1K  [0603R]
R29  10k  [0603R]
U5  OPA350EA/250  [DGK0008A_M]  (parts A,B of 2)

### Blocks framed on the sheet
Fc: 1.6 KHz: C17 R28

### Ports
In_adc (in), Out_adc (out)

### Nets
AGND: C17.2 C18.2 R29.1 U5.4(V-)
AVDD: C18.1 U5.7(V+)
In_adc: R27.2 ; port In_adc
Out_adc: U5.2(IN-) U5.6(OUT) ; port Out_adc
NetC17_1: C17.1 R27.1 R28.1 R29.2
NetR28_2: R28.2 U5.3(IN+)

Not connected (* = marked no-connect by the designer): U5 1(NC)* 5(NC)* 8(NC)*

### Channels
U_Connectors/U_ADC1: designators end in _U_ADC1; ports In_adc=In_ADC1 Out_adc=PB0
U_Connectors/U_ADC2: designators end in _U_ADC2; ports In_adc=In_ADC2 Out_adc=PB1

### Library data of the parts
C17 C18 = CAP: Capacitor
R27 R28 = Resistor_ST: Resistor 0402 / 0603 / 0805; Value: 10K
R29 = Resistor_ST: Resistor 0402 / 0603 / 0805; Value: 10K
U5 = CMP-0272-01143-3: High-Speed, Single-Supply, Rail-to-Rail Operational Amplifier MicroAmplifier(TM) Series, 2.7 to 5.5 V, -40 to 85 degC, 8-pin SOP (DGK8), Green (RoHS & no Sb/Br); Manufacturer: Texas Instruments; Iq per channel(Max)(mA): 8.5; Number of Channels: 1; Vn at 1kHz(Typ)(nV/rtHz): 18; Offset Drift(Typ)(uV/C): 4; IIB(Max)(pA): 10; Total Supply Voltage(Max)(+5V is 5, +/-5V is 10): 5.5; CMRR(Min)(dB): 66; Sub Family: Low Input Bias Current Amp (<=10pA), Low Offset Voltage Amplifier (<=500uV), Low Supply Voltage Amplifier (<=2.7V), Precision Amplifier; Slew Rate(Typ)(V/us): 22; Total Supply Voltage(Min)(+5V is 5, +/-5V is 10): 2.7; Mounting Technology: Surface Mount; ComponentLink1Description: Manufacturer URL; ComponentLink2Description: Datasheet; PackageReference: DGK0008A; ComponentLink1URL: http://www.ti.com/; Vio (25C)(Max)(mV): 1; ComponentLink2URL: http://www.ti.com/general/docs/lit/getliterature.tsp?genericPartNumber=OPA350&fileType=pdf; ComponentLink3Description: Package Specification; PackageDescription: 8-Pin Thin Small Outline, Body 3 x 3 mm, Pitch 0.65 mm; DatasheetVersion: SBOS099C; Code_JEDEC: MO-187; Eco-Plan: Green (RoHS & no Sb/Br); PackageVersion: 4073329/E, 05/2006; ComponentLink3URL: http://www.ti.com/litv/pdf/mpds028d; PartNumber: OPA350EA/250

## Sheet USB_Modificado.SchDoc: USB
size A4; DocumentNumber: MB1137; Revision: B-01; SheetNumber: 4; SheetTotal: 6; Project: NUCLEO-XXXXZX
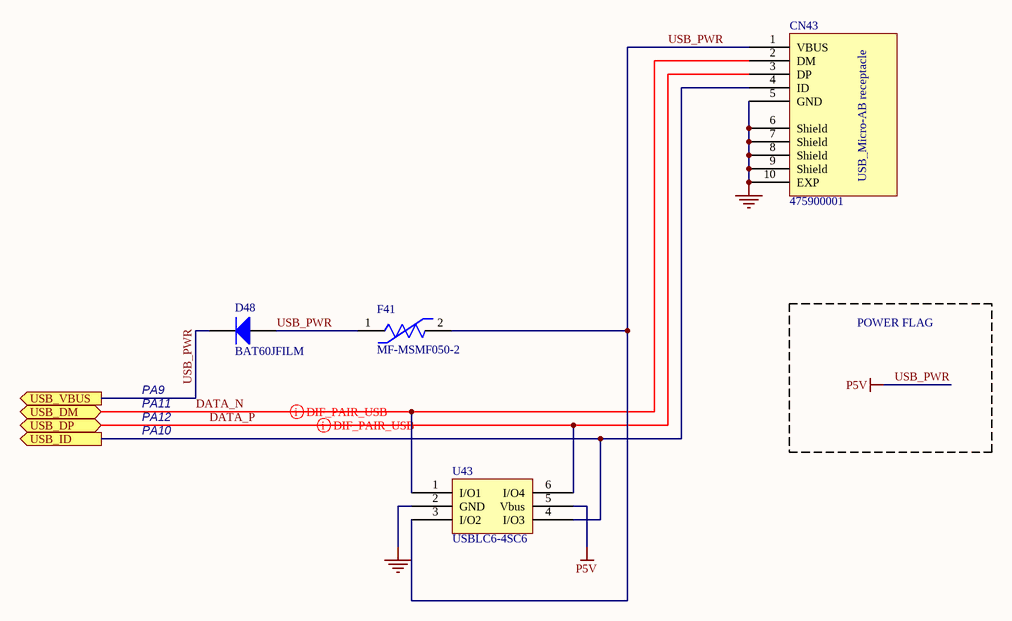
[diagram p5: USB_Modificado.SchDoc]

### Parts
CN43  475900001  [MOLEX_47590001]
D48  BAT60JFILM  [SOD-323]
F41  MF-MSMF050-2  [FP-MF-MSMF050-2-MFG]
U43  USBLC6-4SC6  [SOT23-6L]

### Ports
USB_DM (bidir), USB_DP (bidir), USB_ID (out), USB_VBUS (out)

### Nets
GND: CN43.5(GND) CN43.6(Shield) CN43.7(Shield) CN43.8(Shield) CN43.9(Shield) CN43.10(EXP) U43.2(GND)
USB_PWR: CN43.1(VBUS) D48.1(A) D48.2(K) F41.1 F41.2 U43.3(I/O2) U43.5(Vbus) ; port USB_VBUS  [also labelled P5V]
DATA_N: CN43.2(DM) U43.1(I/O1) ; port USB_DM
DATA_P: CN43.3(DP) U43.6(I/O4) ; port USB_DP
PA10: CN43.4(ID) U43.4(I/O3) ; port USB_ID

### Layout directives
differential pair: DATA_N, DATA_P

### Notes on the sheet
- POWER FLAG
- PA9
- PA10
- PA12
- PA11
- Title:
- Project:
- Size:
- Date:
- A4
- Reference:
- Sheet:
- Revision:
- of
- (in symbol 475900001) USB_Micro-AB receptacle

### Library data of the parts
D48 = BAT60JFILM: as D41 on sheet Connectors; Revision: July-2002: Re-released for DXP Platform.; Order: BAT60JFILM; Manuf_Part_1: BAT60JFILM; Distrib: ST
F41 = CMP-2100-03653-2: PTC RESET FUSE 15V 500MA 1812; Manufacturer: Bourns; Value: 0.15-1Ω; Trip Current: 1A; Automotive Grade: Grade 3; Trip Time: 0.15s; Current Rating: 100A; Hold Current: 0.5A; Height: 0.85mm; Package: 1812; Voltage Rating: 15V; Temperature Range High: +85°C; Device Class L2: PTC Resettable Fuses; Lead Free: Yes; ComponentLink2URL: http://www.bourns.com/docs/Product-Datasheets/mfmsmf.pdf; Ambient Temperature Range High: +85°C; Mouser Description: PTC Resettable Fuse 0.5A(hold) 1A(trip) 15V 100A 0.8W 0.15s 0.15Ohm SMD Solder Pad 1812 T/R; Digikey Description: PTC RESET FUSE 15V 500MA 1812; Manufacturer Part Number: MF-MSMF050-2; Resistance: 0.15-1Ω; Category: Fuse; ComponentLink2Description: Datasheet; Automotive: Yes; Temperature Range Low: -40°C; RoHS: TRUE; Device Class L1: Circuit Protection; Temperature: -40°C to +85°C; Octopart: https://octopart.com/mf-msmf050-2-bourns-28047; Ambient Temperature Range Low: -40°C; Device Class L3: unset

## Sheet Flash_memory.SchDoc
size A4
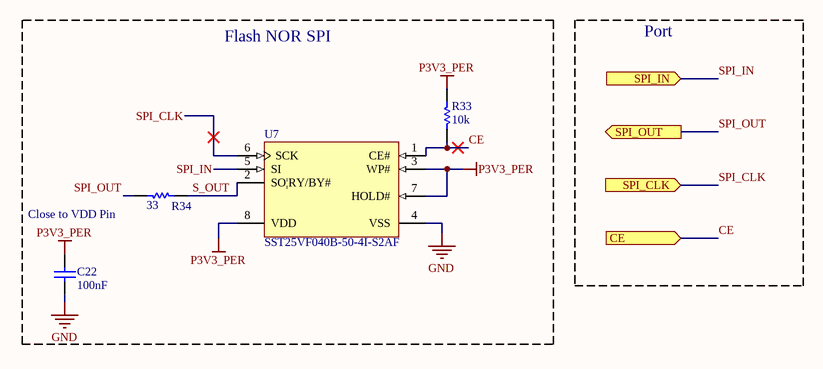
[diagram p6: Flash_memory.SchDoc]

### Parts
C22  100nF  [0603C]
R33  10k  [0603R]
R34  33  [0603R]
U7  SST25VF040B-50-4I-S2AF  [MCHP-SOIC-S2A8_N]

### Ports
CE (in), SPI_CLK (in), SPI_IN (in), SPI_OUT (out)

### Nets
GND: C22.1 U7.4(VSS)
P3V3_PER: C22.2 R33.2 U7.3(WP#) U7.7(HOLD#) U7.8(VDD)  [project net P3V3]
CE: R33.1 U7.1(CE#) ; port CE
S_OUT: R34.2 U7.2(SO|RY/BY#)
SPI_CLK: U7.6(SCK) ; port SPI_CLK
SPI_IN: U7.5(SI) ; port SPI_IN
SPI_OUT: R34.1 ; port SPI_OUT  [project net PB14]

### Notes on the sheet
- Flash NOR SPI
- Port
- (near R34) Close to VDD Pin

### Library data of the parts
C22 = Capacitor_ST: Capacitor 0402 / 0603 / 0805; Revision: July-2002: Re-released for DXP Platform.; Value: 100nF
R33 R34 = Res1: Resistor; Value: 1K; Published: 8-Jun-2000; Revision: July-2002: Re-released for DXP Platform.; Publisher: Altium Limited
U7 = CMP-0378-00057-1: 4 Mbit SPI Serial Flash, 2.7 to 3.6 V, 50 MHz, -40 to 85 degC, 8-pin SOIC (S2A8), Tube; Manufacturer: Microchip; DatasheetVersion: Rev. A; ComponentLink3Description: Package Specification; ComponentLink1Description: Manufacturer URL; PackageDescription: 8-Lead Plastic Small Outline Intergrated Circuit, 5.275 x 5.275 mm Body, 1.27 mm Pitch; ComponentLink3URL: http://ww1.microchip.com/downloads/en/DeviceDoc/25051A.pdf; PartNumber: SST25VF040B-50-4I-S2AF; ComponentLink2URL: http://ww1.microchip.com/downloads/en/DeviceDoc/25051A.pdf; ComponentLink1URL: http://www.microchip.com; ComponentLink2Description: Datasheet; ComponentLink4Description: Product URL; PackageReference: SOIC-S2A8; ComponentLink4URL: http://www.microchip.com/SST25VF040B; Mounting Technology: Surface Mount; PackageVersion: Rev. A

## Sheet Alimentacion.SchDoc
size A4
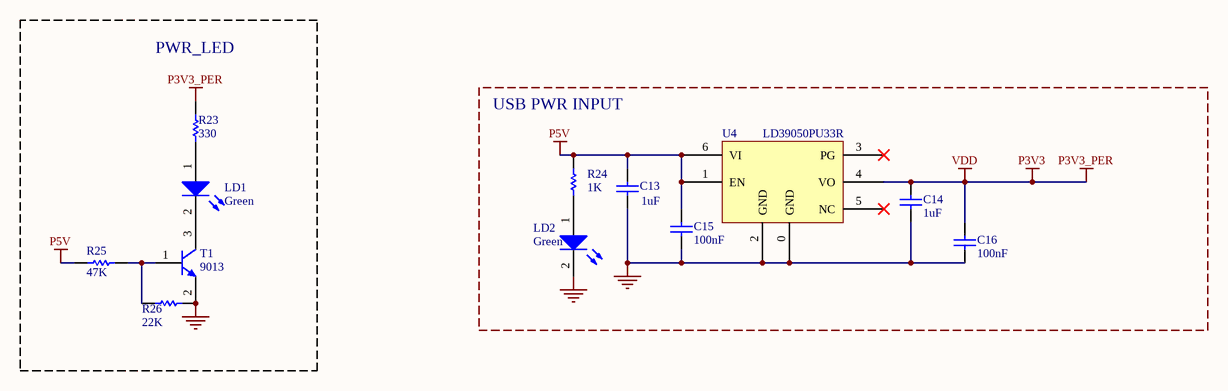
[diagram p7: Alimentacion.SchDoc]

### Parts
C13  1uF  [0603C]
C14  1uF  [0603C]
C15  100nF  [0603C]
C16  100nF  [0603C]
LD1  Green  [0603D-G]
LD2  Green  [0603D-G]
R23  330  [0603R]
R24  1K  [0603R]
R25  47K  [0603R]
R26  22K  [0603R]
T1  9013  [SOT-23]
U4  LD39050PU33R  [DFN6_0R95_3x3_TP]

### Blocks framed on the sheet
PWR_LED: LD1 R23 R25 R26 T1
USB PWR INPUT: C13-C16 LD2 R24 U4

### Nets
GND: C13.2 C14.2 C15.1 C16.1 LD2.2(K) R26.1 T1.2(E) U4.0(GND) U4.2(GND)
P3V3: C14.1 C16.2 R23.2 U4.4(VO)  [also labelled P3V3_PER, VDD]
P5V: C13.1 C15.2 R24.2 R25.1 U4.1(EN) U4.6(VI)  [project net USB_PWR]
NetLD1_1: LD1.1(A) R23.1
NetLD1_2: LD1.2(K) T1.3(C)
NetLD2_1: LD2.1(A) R24.1
NetR25_2: R25.2 R26.2 T1.1(B)

Not connected (* = marked no-connect by the designer): U4 3(PG)* 5(NC)*

### Library data of the parts
C13 C14 = CAP SMD 0603  X5R 1µF 25V 10%: as C60 on sheet MCU; Manufacturer: *; Manufacturer P/N: *; Order code Farnell: 1288202RL; Value: 1µF; Power: *; Technology: X5R; Temperature  Factor: *; Temperature Max: +125°C; Temperature Min: -55°C; STS Code: *
C15 C16 = Capacitor_ST: Capacitor 0402 / 0603 / 0805; Revision: July-2002: Re-released for DXP Platform.; Value: 100nF
LD1 LD2 = LED2: as LD42 on sheet MCU; Published: 8-Jun-2000; Revision: July-2002: Re-released for DXP Platform.; Publisher: Altium Limited
R23 R25 R26 = res1: Resistor; Value: 1K; Published: 8-Jun-2000; Revision: July-2002: Re-released for DXP Platform.; Publisher: Altium Limited
R24 = Resistor_ST: Resistor 0402 / 0603 / 0805; Value: 10K
T1 = NPN: NPN Bipolar Transistor; Code - JEDEC: TO-226-AA; Published: 8-Jun-2000; Revision: July-2002: Re-released for DXP Platform.; Publisher: Altium Limited
U4 = LD39050P

## Sheet CAN.SchDoc
size A4
Used 2 times, as channels U_Can1, U_Can2. Parts and nets are listed once, with the designators drawn on the sheet.
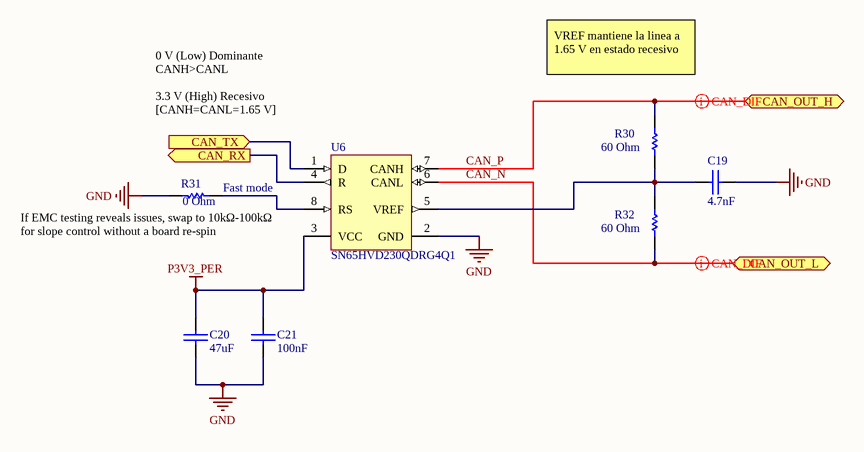
[diagram p8: CAN.SchDoc]

### Parts
C19  4.7nF  [0603C]
C20  47uF  [0603C]
C21  100nF  [0603C]
R30  60 Ohm  [0603R]
R31  0 Ohm  [0603R]
R32  60 Ohm  [0603R]
U6  SN65HVD230QDRG4Q1  [D0008A_M]

### Ports
CAN_OUT_H (bidir), CAN_OUT_L (bidir), CAN_RX (out), CAN_TX (in)

### Nets
GND: C19.2 C20.1 C21.1 R31.2 U6.2(GND)
P3V3_PER: C20.2 C21.2 U6.3(VCC)
CAN_N: R32.1 U6.6(CANL) ; port CAN_OUT_L
CAN_P: R30.2 U6.7(CANH) ; port CAN_OUT_H
CAN_RX: U6.4(R) ; port CAN_RX
CAN_TX: U6.1(D) ; port CAN_TX
NetC19_1: C19.1 R30.1 R32.2 U6.5(VREF)
NetR31_1: R31.1 U6.8(RS)

### Channels
U_Can1: designators end in _U_Can1; ports CAN_OUT_H=CAN_P CAN_OUT_L=CAN_N CAN_RX=PD0 CAN_TX=PD1
U_Can2: designators end in _U_Can2; ports CAN_OUT_H=CAN_P CAN_OUT_L=CAN_N CAN_RX=PB5 CAN_TX=PB6

### Layout directives
differential pair: CAN_N, CAN_P

### Notes on the sheet
- VREF mantiene la linea a 1.65 V en estado recesivo
- 0 V (Low) Dominante CANH>CANL
  3.3 V (High) Recesivo  [CANH=CANL=1.65 V]
- (near R31) Fast mode
- (near R31) If EMC testing reveals issues, swap to 10kΩ-100kΩ for slope control without a board re-spin

### Library data of the parts
C19-C21 = CAP: Capacitor
R30 R32 = Res1: Resistor; Value: 60; Ordered by: Subcon; Published: 8-Jun-2000; Revision: July-2002: Re-released for DXP Platform.; Publisher: Altium Limited
R31 = Res1: Resistor; Value: 1K; Published: 8-Jun-2000; Revision: July-2002: Re-released for DXP Platform.; Publisher: Altium Limited
U6 = CMP-0315-00041-2: Automotive Catalog 3.3 V CAN Transceiver, 17 mA, -40 to 125 degC, 8-pin SOIC (D), Green (RoHS & no Sb/Br); Manufacturer: Texas Instruments; ICC(Max)(mA): 17; Drivers Per Package: 1; Supply Voltage(s)(V): 3.3; Transient Pulse Protection(V): -25 to 25; PackageDescription: 8-Pin Plastic Small Outline Integrated Circuit, 4.9 x 3.9 mm, Pitch 1.27 mm Pitch; SubFamily: CAN; Rating: Automotive; ComponentLink1Description: Datasheet; Receivers Per Package: 1; Isolated: No; DatasheetVersion: SGLS398A; PackageReference: D0008A; PartNumber: SN65HVD230QDRG4Q1; Code_JEDEC: MS-012AA; Footprint: PCA82C250; Eco-Plan: Green (RoHS & no Sb/Br); PackageVersion: revM, Jun-2011; ComponentLink1URL: http://www.ti.com/general/docs/lit/getliterature.tsp?genericPartNumber=SN65HVD230Q-Q1&fileType=pdf; Mounting Technology: Surface Mount

## Nets that join several sheets
AGND: MCU (C45.2 C46.2 SB41.1 U42.31), Connectors (E41.A2 E41.A4), U_Connectors/U_ADC1 (C17_U_ADC1.2 C18_U_ADC1.2 R29_U_ADC1.1 U5_U_ADC1.4), U_Connectors/U_ADC2 (C17_U_ADC2.2 C18_U_ADC2.2 R29_U_ADC2.1 U5_U_ADC2.4)
AVDD: MCU (5 pins), U_Connectors/U_ADC1 (C18_U_ADC1.1 U5_U_ADC1.7), U_Connectors/U_ADC2 (C18_U_ADC2.1 U5_U_ADC2.7)
GND: MCU (39 pins), Ethernet (21 pins), Connectors (27 pins), USB_Modificado (7 pins), Flash_memory (C22.1 U7.4), Alimentacion (9 pins), U_Can1 (5 pins), U_Can2 (5 pins)
P3V3: MCU (35 pins), Ethernet (8 pins), Connectors (CN41.5 CN41.6 R42.2 U41.5), Flash_memory (5 pins), Alimentacion (C14.1 C16.2 R23.2 U4.4), U_Can1 (C20_U_Can1.2 C21_U_Can1.2 U6_U_Can1.3), U_Can2 (C20_U_Can2.2 C21_U_Can2.2 U6_U_Can2.3)
USB_PWR: MCU (R52.1), Connectors (CN41.3 CN41.4), USB_Modificado (7 pins), Alimentacion (6 pins)
CAN_N: Connectors (D44.1 J42.2), U_Can2 (R32_U_Can2.1 U6_U_Can2.6)
CAN_N: Connectors (D45.1 J41.2), U_Can1 (R32_U_Can1.1 U6_U_Can1.6)
CAN_P: Connectors (D44.2 J42.1), U_Can2 (R30_U_Can2.2 U6_U_Can2.7)
CAN_P: Connectors (D45.2 J41.1), U_Can1 (R30_U_Can1.2 U6_U_Can1.7)
CE: MCU (U42.73), Flash_memory (R33.1 U7.1)
ConC6: MCU (R70.1), Connectors (CN41.10 D43.1)
ConD8: MCU (R51.2), Connectors (CN41.28 D47.6)
ConD9: MCU (R54.2), Connectors (CN41.26 D47.4)
ConD10: MCU (R57.2), Connectors (CN41.24 D47.3)
ConD11: MCU (R58.2), Connectors (CN41.20 D47.1)
ConD12: MCU (R61.2), Connectors (CN41.25 D46.3)
ConD13: MCU (R63.1), Connectors (CN41.27 D46.1)
ConD14: MCU (R65.2), Connectors (CN41.19 D46.6)
ConD15: MCU (R68.1), Connectors (CN41.23 D46.4)
ConG2: MCU (R56.1), Connectors (CN41.15 D42.3)
ConG3: MCU (R59.1), Connectors (CN41.17 D42.1)
ConG4: MCU (R62.2), Connectors (CN41.9 D42.6)
ConG5: MCU (R64.2), Connectors (CN41.11 D42.4)
ConG6: MCU (R67.1), Connectors (CN41.18 D43.6)
ConG7: MCU (R69.1), Connectors (CN41.16 D43.4)
ConG8: MCU (R73.1), Connectors (CN41.12 D43.3)
DATA_N: MCU (U42.103), USB_Modificado (CN43.2 U43.1)
DATA_P: MCU (U42.104), USB_Modificado (CN43.3 U43.6)
In_ADC1: Connectors (E41.A1), U_Connectors/U_ADC1 (R27_U_ADC1.2)
In_ADC2: Connectors (E41.A3), U_Connectors/U_ADC2 (R27_U_ADC2.2)
nRST: MCU (B41.2 B41.3 C43.2 U42.25), Ethernet (U3.15), Connectors (R45.2)
PA1: MCU (U42.35), Ethernet (R19.2)
PA2: MCU (U42.36), Ethernet (R17.1 U3.12)
PA7: MCU (U42.43), Ethernet (R16.2)
PA10: MCU (U42.102), USB_Modificado (CN43.4 U43.4)
PA13: MCU (U42.105), Connectors (R44.2)
PA14: MCU (U42.109), Connectors (R43.2)
PB0: MCU (U42.46), U_Connectors/U_ADC1 (U5_U_ADC1.2 U5_U_ADC1.6)
PB1: MCU (U42.47), U_Connectors/U_ADC2 (U5_U_ADC2.2 U5_U_ADC2.6)
PB3: MCU (U42.133), Connectors (R46.2)
PB5: MCU (U42.135), U_Can2 (U6_U_Can2.4)
PB6: MCU (U42.136), U_Can2 (U6_U_Can2.1)
PB13: MCU (U42.74), Ethernet (U3.18)
PB14: MCU (U42.75), Flash_memory (R34.1)
PC1: MCU (U42.27), Ethernet (U3.13)
PC4: MCU (U42.44), Ethernet (R8.2)
PC5: MCU (U42.45), Ethernet (R9.2)
PD0: MCU (U42.114), U_Can1 (U6_U_Can1.4)
PD1: MCU (U42.115), U_Can1 (U6_U_Can1.1)
PE1: MCU (U42.142), Connectors (R48.2)
PE7: MCU (U42.58), Connectors (CN41.33)
PE8: MCU (U42.59), Connectors (CN41.31)
PG9: MCU (U42.124), Connectors (CN41.34)
PG11: MCU (U42.126), Ethernet (U3.16)
PG13: MCU (U42.128), Ethernet (U3.17)
PG14: MCU (U42.129), Connectors (CN41.32)
SPI_CLK: MCU (R55.2), Flash_memory (U7.6)
SPI_IN: MCU (R60.2), Flash_memory (U7.5)